# EasyEDA Pro project 单向户外电源_明月班.epro, board PCB2
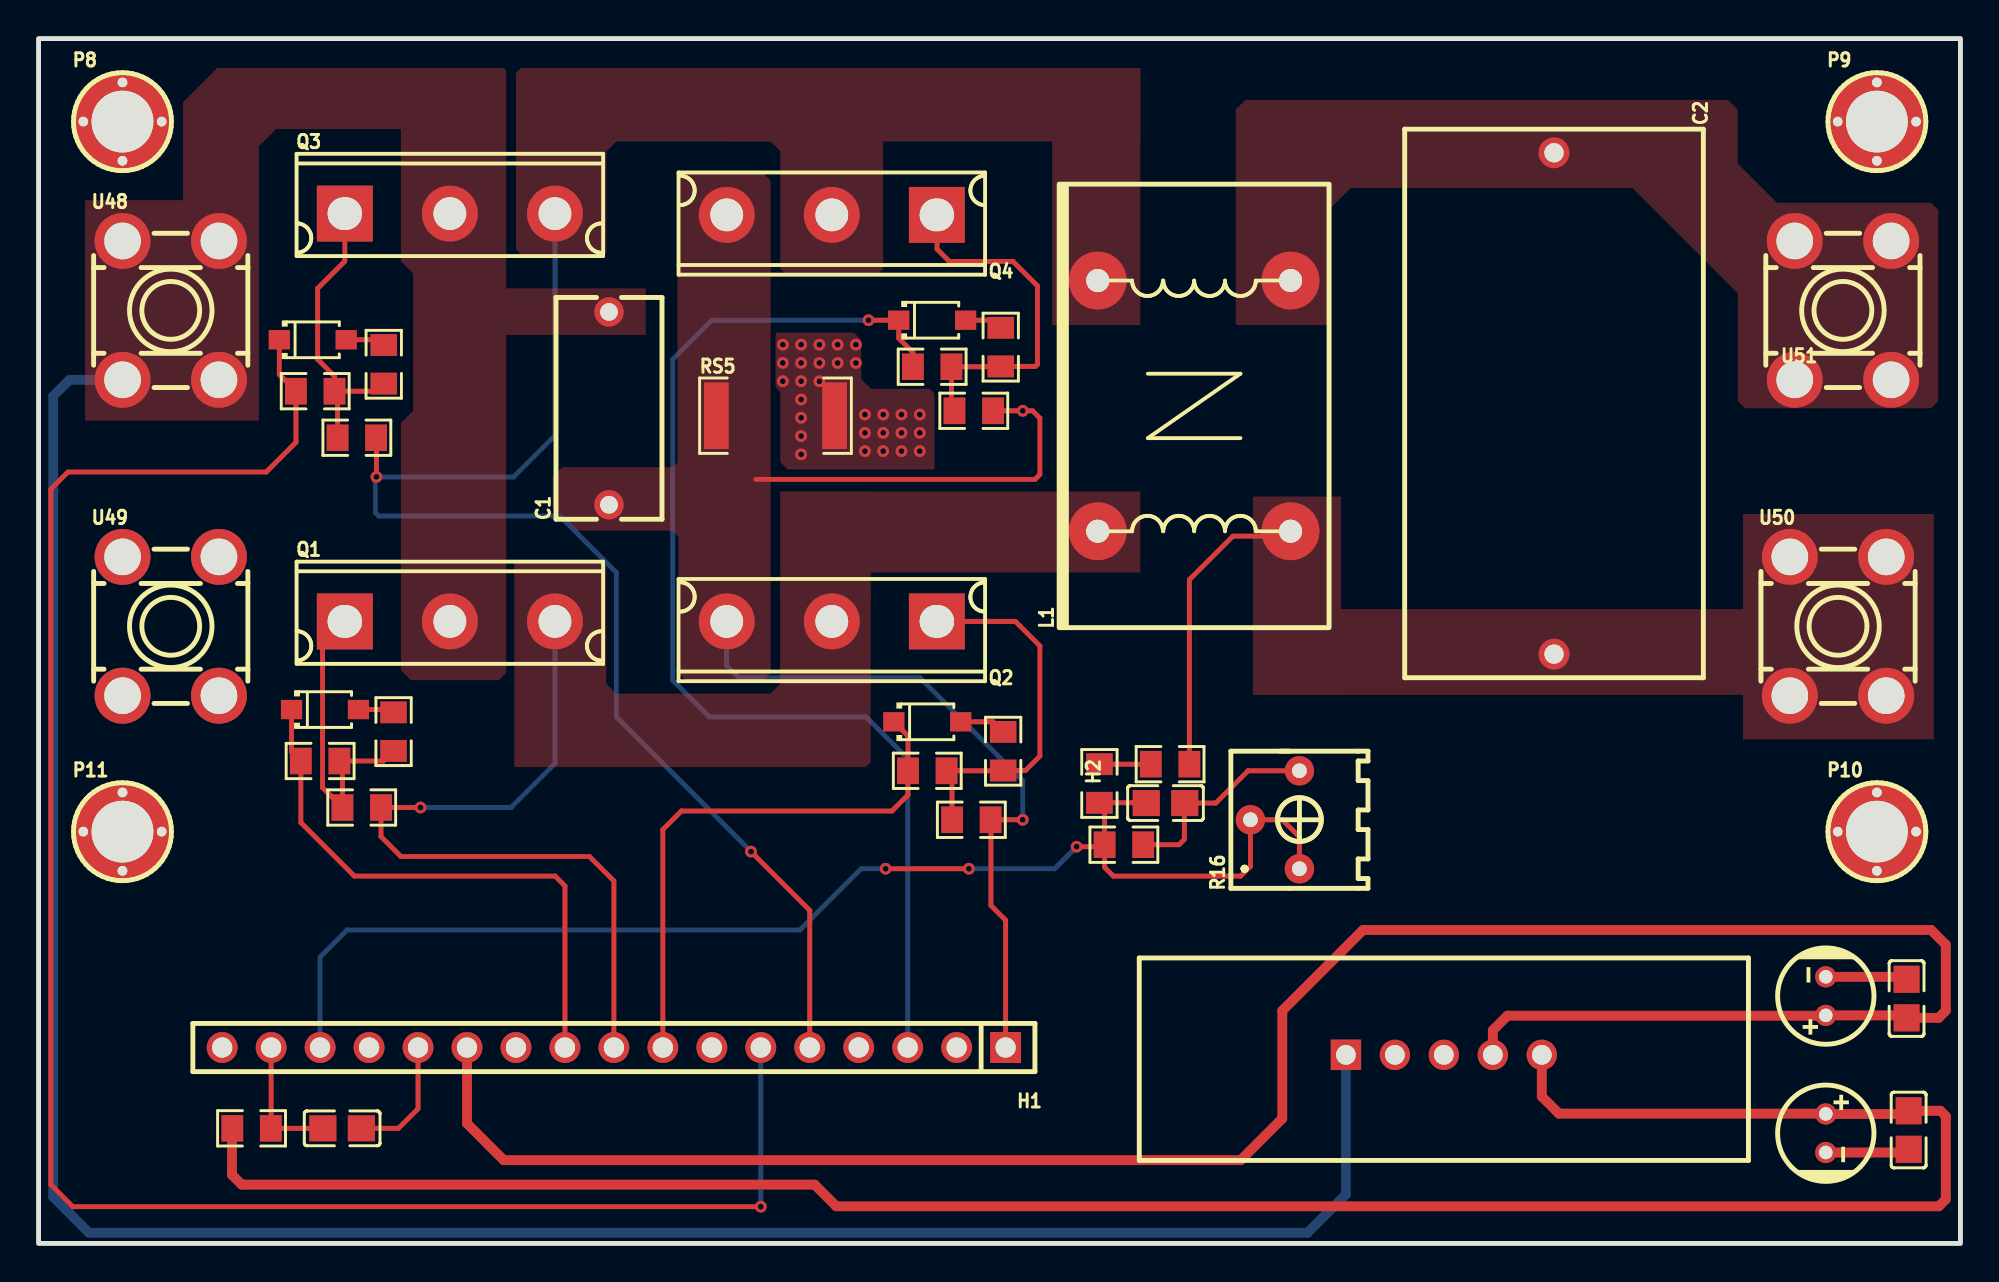
[diagram p10: board, top side]
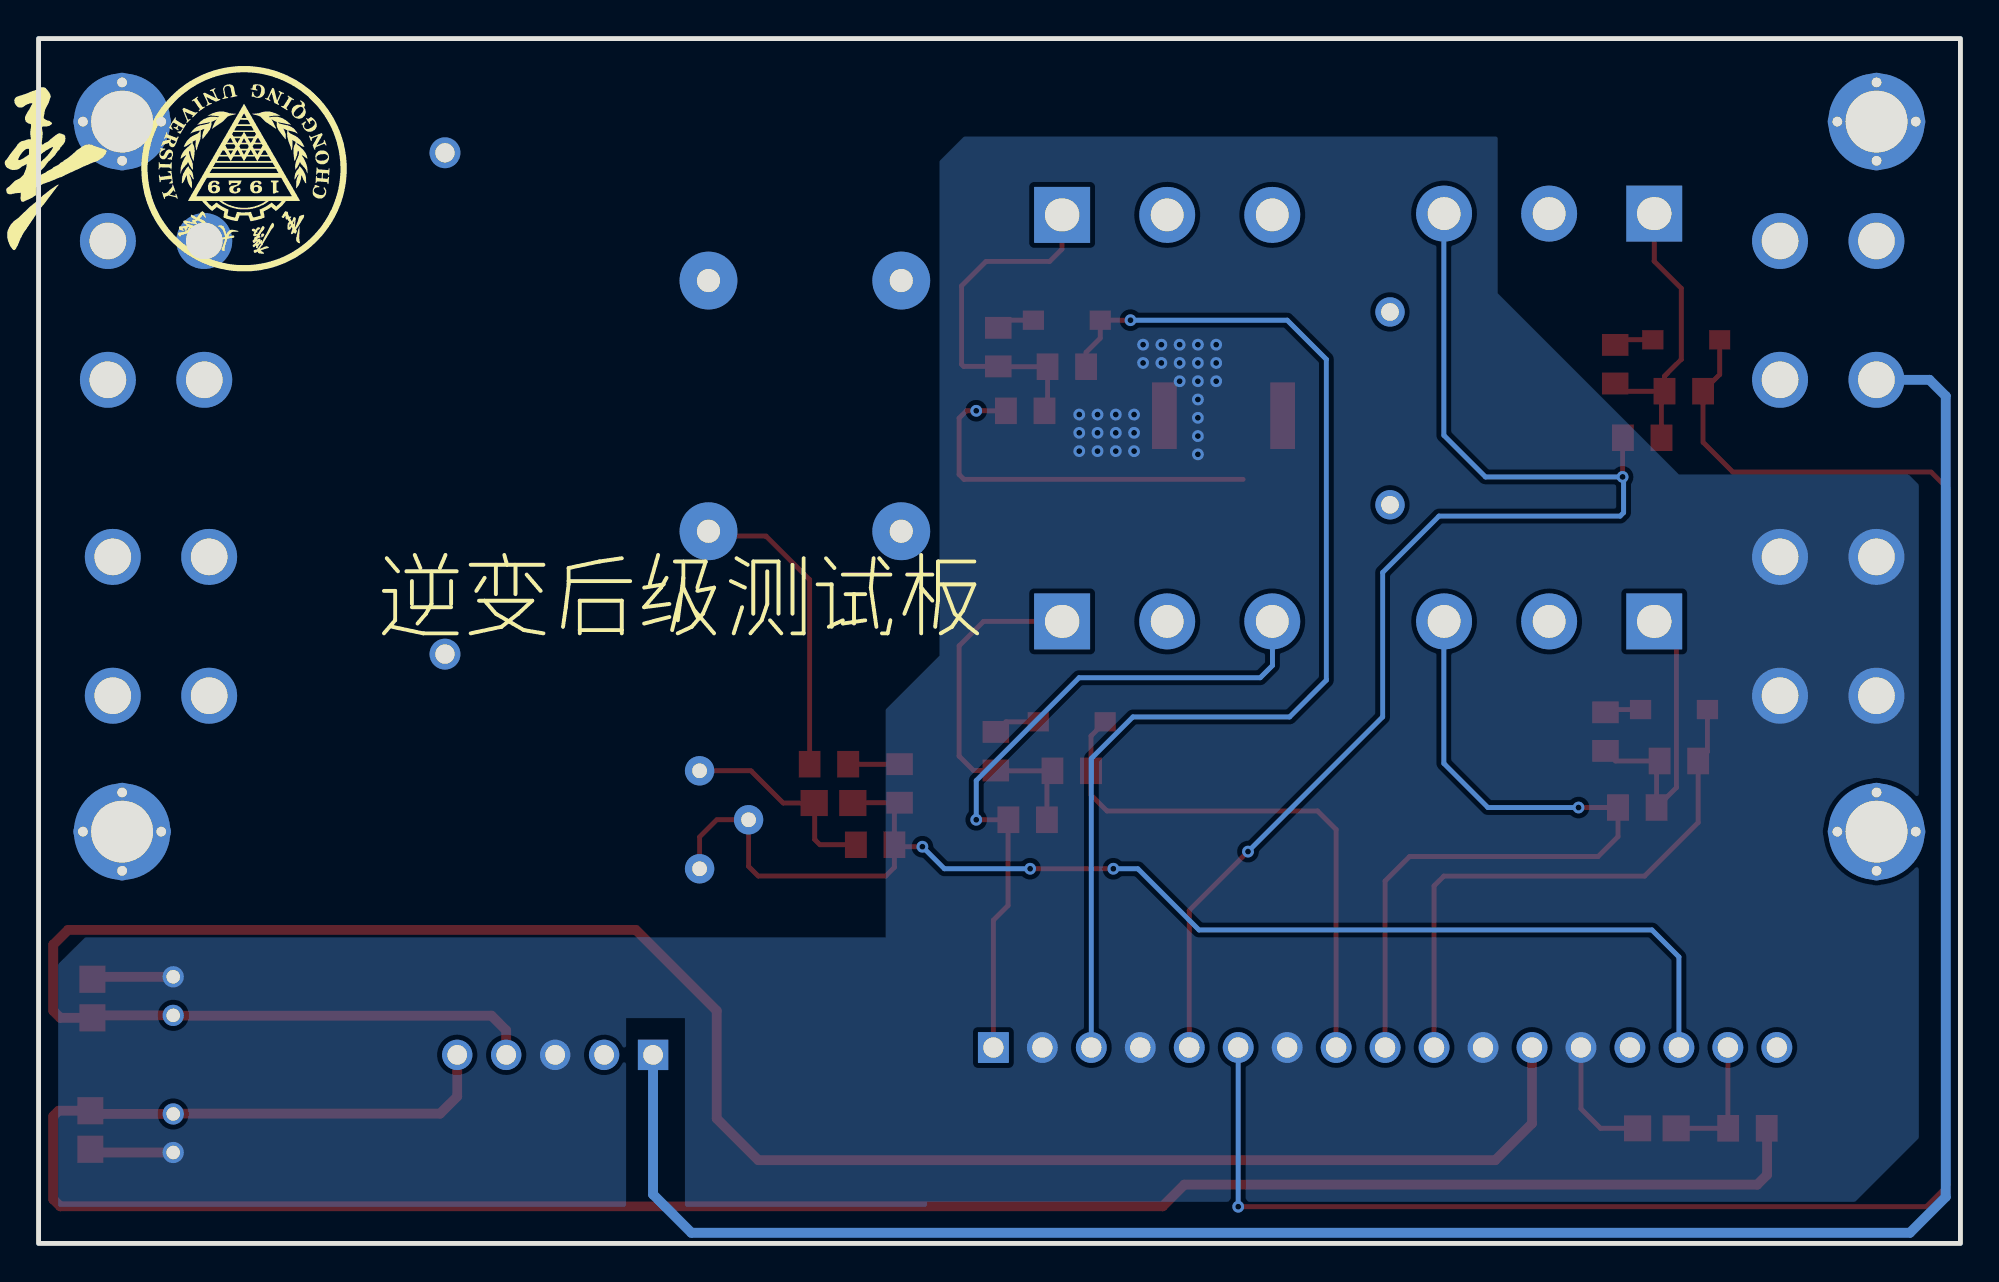
[diagram p11: board, bottom side, seen from below]

Outline 99.7 x 62.48 mm; copper layers: Top Layer, Bottom Layer. Coordinates in mm from the lower left corner of the outline.
Outline path: rectangle 0,62.48 99.7,0
Stack: Top Layer 0.035mm / Dielectric1 1.51mm FR4 er 4.5 / Bottom Layer 0.035mm

## Design rules (mm)
template: 自定义配置
spacing copperThickness1oz (default): track to track 0.102, other pairs 0.152 to 0.3
spacing copperThickness2oz: track to track 0.203, other pairs 0.152 to 0.3
track width copperThickness1oz (default): min 0.127, default 0.254, max 2.54
track width copperThickness2oz: min 0.203, default 0.254, max 2.54
differential pair differentialPair (default): width min 0.127, default 0.254, max 2.54; gap min 0.152, default 0.152
via viaSize (default): diameter min 0.5, default 0.61, max 10; hole min 0.3, default 0.305, max 6.3

## Placement (name value [footprint] x y rotation side)
C1  100nF  [CAP-TH_L11.5-W5.5-P10.00-D0.6]  29.59 43.31 90 top
C2  4.7uF  [CAP-TH_L28.5-W15.5-P26.0-D0.8]  78.61 43.56 270 top
C3  100nF  [C0805]  58.46 22.84 180 top
C7  100uF  [CAP-TH_BD5.0-P2.00-D0.5-FD-1]  92.71 12.83 90 top
C8  100nF  [C0805]  96.9 12.7 270 top
C11  100nF  [C0805]  15.75 5.97 0 top
C12  100uF  [CAP-TH_BD5.0-P2.00-D0.5-FD-1]  92.71 5.72 270 top
C13  100nF  [C0805]  97.01 5.88 90 top
D1  1N4148W  [SOD-123F_L2.7-W1.6-LS3.8-RD]  14.86 27.69 0 top
D2  1N4148W  [SOD-123F_L2.7-W1.6-LS3.8-RD]  46.1 27.05 0 top
D3  1N4148W  [SOD-123F_L2.7-W1.6-LS3.8-RD]  14.22 46.86 0 top
D4  1N4148W  [SOD-123F_L2.7-W1.6-LS3.8-RD]  46.36 47.88 0 top
H1  -  [HDR-TH_17P-P2.54-V-F]  29.85 10.16 180 top
H2  -  [EG1185辅助电源]  72.9 9.78 0 top
L1  -  [SQ1918]  59.94 43.43 90 top
P8  -  [固定孔]  4.35 58.18 0 top
P9  -  [固定孔]  95.36 58.18 0 top
P10  -  [固定孔]  95.36 21.36 0 top
P11  -  [固定孔]  4.35 21.36 0 top
Q1  K40EH5  [TO-247AC-3_L15.8-W5.0-P5.46-L]  21.34 32.26 0 top
Q2  K40EH5  [TO-247AC-3_L15.8-W5.0-P5.46-L]  41.15 32.26 180 top
Q3  K40EH5  [TO-247AC-3_L15.8-W5.0-P5.46-L]  21.34 53.41 0 top
Q4  K40EH5  [TO-247AC-3_L15.8-W5.0-P5.46-L]  41.15 53.34 180 top
R1  20R  [R0805]  14.61 25.02 0 top
R2  10K  [R0805]  16.76 22.61 0 top
R3  4.7R  [R0805]  18.42 26.54 270 top
R5  20R  [R0805]  46.1 24.51 0 top
R6  10K  [R0805]  48.39 21.97 0 top
R7  4.7R  [R0805]  50.04 25.53 270 top
R8  20R  [R0805]  14.35 44.2 0 top
R9  10K  [R0805]  16.51 41.78 0 top
R10  4.7R  [R0805]  17.91 45.59 270 top
R11  20R  [R0805]  46.36 45.47 0 top
R12  10K  [R0805]  48.51 43.18 0 top
R13  4.7R  [R0805]  49.91 46.48 270 top
R14  100K  [R0805]  58.7 24.85 0 top
R15  100K  [R0805]  55.03 23.85 90 top
R16  10K  [RES-ADJ-TH_3362P]  64.14 21.97 90 top
R17  10K  [R0805]  56.3 20.68 180 top
R24  10K  [R0805]  11.05 5.97 180 top
RS5  20mΩ  [R2512]  38.23 42.93 0 top
U48  T44001  [CONN-TH_T44001]  6.86 48.39 0 top
U49  T44001  [CONN-TH_T44001]  6.86 32 0 top
U50  T44001  [CONN-TH_T44001]  93.35 32 0 top
U51  T44001  [CONN-TH_T44001]  93.6 48.39 0 top

## Footprints (pads in the part's own frame, mm; a bottom-side part is the same pattern mirrored in y, then rotated)
C0805
  rect 1.41x1.35 smd: 1(-1,0) 2(1,0)
CAP-TH_BD5.0-P2.00-D0.5-FD-1
  round 1.1 hole 0.7: 1(-1,0) 2(1,0)
CAP-TH_L11.5-W5.5-P10.00-D0.6
  round 1.524 hole 0.914: 1(-5,0) 2(5,0)
CAP-TH_L28.5-W15.5-P26.0-D0.8
  round 1.6 hole 1: 1(-13,0) 2(13,0)
CONN-TH_T44001
  round 2.9 hole 1.9: 1(-2.5,3.6) 2(-2.5,-3.6) 3(2.5,-3.6) 4(2.5,3.6)
EG1185辅助电源
  rect 1.575x1.575 hole 1.02: 1(-5.08,0)
  round 1.575 hole 1.02: 2(-2.54,0) 3(0,0) 4(2.54,0) 5(5.08,0)
HDR-TH_17P-P2.54-V-F
  rect 1.6x1.6 hole 1.05: 1(-20.32,0)
  round 1.6 hole 1.05: 2(-17.78,0) 3(-15.24,0) 4(-12.7,0) 5(-10.16,0) 6(-7.62,0) 7(-5.08,0) 8(-2.54,0) 9(0,0) 10(2.54,0) 11(5.08,0) 12(7.62,0) 13(10.16,0) 14(12.7,0) 15(15.24,0) 16(17.78,0) 17(20.32,0)
R0805
  rect 1.133x1.377 smd: 1(-1,0) 2(1,0)
R2512
  rect 1.282x3.456 smd: 1(-3.067,0) 2(3.067,0)
RES-ADJ-TH_3362P
  round 1.524 hole 0.762: 1(-2.54,-1.27) 2(0,1.27) 3(2.54,-1.27)
SOD-123F_L2.7-W1.6-LS3.8-RD
  rect 1.1x1 smd: 1(-1.735,0) 2(1.735,0)
SQ1918
  round 3 hole 1.2: 1(-6.5,5) 2(6.5,5) 3(6.5,-5) 4(-6.5,-5)
TO-247AC-3_L15.8-W5.0-P5.46-L
  rect 2.9x2.9 hole 1.785x1.7: 1(-5.45,0)
  round 2.9 hole 1.7: 2(0,0) 3(5.45,0)
固定孔
  round 1 hole 0.5x0.505: 1(-2.032,0) 3(2.032,0)
  round 1 hole 0.505x0.5: 2(0,-2.032) 4(0,2.032)
  round 5 hole 3.205x3.2: 5(0,0)

## Nets
5V: C12.1 C13.2 H2.5 R24.2
15V: C7.1 C8.2 H1.12 H2.4
400V: C1.2 H2.1 Q1.2 Q3.2 U48.1 U48.2 U48.3 U48.4
GND-400V: C7.2 C8.1 C11.2 C12.2 C13.1 H1.2 H1.4 H1.7 H1.11 H1.13 H2.3 RS5.2 U49.1 U49.2 U49.3 U49.4
1HO: D3.1 H1.6 R8.1
1LO: D4.1 H1.3 R11.1
2HO: D1.1 H1.10 R1.1
2LO: D2.1 H1.8 R5.1
L: C2.2 L1.4 R14.2 U50.1 U50.2 U50.3 U50.4
N: C2.1 L1.3 U51.1 U51.2 U51.3 U51.4
VFB: C3.2 H1.15 R15.1 R16.1 R16.2 R17.2
VS1: H1.5 L1.2 Q3.3 Q4.2 R9.2
VS2: H1.9 L1.1 Q1.3 Q2.2 R2.2
$1N462: D1.2 R3.1
$1N467: Q1.1 R1.2 R2.1 R3.2
$1N750: D2.2 R7.1
$1N752: Q2.1 R5.2 R6.1 R7.2
$1N762: C1.1 H1.1 Q2.3 Q4.3 R6.2 R12.2 RS5.1
$1N1150: D3.2 R10.1
$1N1152: Q3.1 R8.2 R9.1 R10.2
$1N1168: D4.2 R13.1
$1N1170: Q4.1 R11.2 R12.1 R13.2
$1N1865: R14.1 R15.2
$1N2048: C3.1 R16.3 R17.1
$1N2358: C11.1 H1.16 R24.1

Pads without a net: H1 14 17; H2 2; P8 1 2 3 4 5; P9 1 2 3 4 5; P10 1 2 3 4 5; P11 1 2 3 4 5

## Via types
v1: diameter 0.61, hole 0.305, Top Layer to Bottom Layer, 39 vias

## Routing (per net, layer and track width the routed paths; a pad name or vN(x,y) marks a point on that pad's centre or on a via; arc(x,y) is an arc through that point)
5V: length 120.1
  Top Layer w0.508: R24.2 10.03,5.95 10.03,3.56 10.54,3.05 40.26,3.05 41.38,1.93 98.57,1.93 98.93,2.29 98.93,6.6 98.66,6.88 C13.2 96.84,6.72 C12.1 92.69,6.73 78.87,6.73 77.98,7.62 77.98,9.78
15V: length 118.7
  Top Layer w0.508: H2.4 75.44,11.05 76.2,11.81 92.69,11.81 C7.1 96.77,11.83 C8.2 98.57,11.7 98.93,12.07 98.93,15.49 98.17,16.26 68.71,16.26 64.52,12.07 64.52,6.48 62.36,4.32 24.13,4.32 22.23,6.22 H1.12
400V: length 121.4
  Bottom Layer w0.508: H2.1 67.82,2.54 65.83,0.55 2.62,0.55 0.76,2.41 0.76,43.94 1.61,44.79 4.36,44.79
GND-400V: length 15.1
  Top Layer w0.254: H1.13 19.69,6.99 18.67,5.97 C11.2
  Top Layer w0.508: C8.1 96.77,13.83 C7.2 ; C13.1 96.84,4.72 C12.2
  vias: v1(38.61,46.61) v1(38.61,45.66) v1(38.61,44.71) v1(39.56,46.61) v1(39.56,45.66) v1(39.56,44.71) v1(39.56,43.77) v1(39.56,42.82) v1(39.56,41.87) v1(39.56,40.92) v1(40.5,46.61) v1(40.5,45.66) v1(40.5,44.71) v1(41.45,46.61) v1(41.45,45.66) v1(42.4,46.61) v1(42.4,45.66) v1(42.87,42.99) v1(42.87,42.04) v1(42.87,41.09) v1(43.82,42.99) v1(43.82,42.04) v1(43.82,41.09) v1(44.76,42.99) v1(44.76,42.04) v1(44.76,41.09) v1(45.71,42.99) v1(45.71,42.04) v1(45.71,41.09)
1HO: length 101
  Top Layer w0.254: v1(37.47,1.91) 1.78,1.91 0.64,3.05 0.64,39.12 1.52,40.01 11.81,40.01 13.35,41.55 R8.1 12.49,45.06 D3.1
  Bottom Layer w0.254: v1(37.47,1.91) H1.6
1LO: length 60.8
  Top Layer w0.254: R11.1 45.36,46.21 44.62,46.95 D4.1 v1(43.05,47.88)
  Bottom Layer w0.254: v1(43.05,47.88) 34.92,47.88 32.89,45.85 32.89,29.21 34.8,27.31 42.93,27.31 45.08,25.15 H1.3
2HO: length 29.5
  Top Layer w0.254: D1.1 13.12,25.5 R1.1 13.61,21.83 16.38,19.05 26.8,19.05 27.31,18.54 H1.10
2LO: length 28.9
  Top Layer w0.254: D2.1 45.1,26.32 R5.1 45.1,23.26 44.27,22.43 33.35,22.43 32.39,21.46 H1.8
L: length 15.9
  Top Layer w0.254: R14.2 59.7,34.42 61.95,36.68 65.07,36.68
VFB: length 68.6
  Top Layer w0.254: R17.2 55.3,19.5 55.75,19.05 62.36,19.05 62.86,19.56 R16.2 64.52,21.97 65.41,21.08 R16.1 ; R17.2 55.2,20.57 v1(53.85,20.57) ; R17.2 55.3,22.58 R15.1 57.44,22.85 C3.2 ; v1(43.94,19.43) v1(48.26,19.43)
  Bottom Layer w0.254: v1(53.85,20.57) 52.7,19.43 v1(48.26,19.43) ; v1(43.94,19.43) 42.67,19.43 39.5,16.26 16,16.26 14.61,14.86 H1.15
VS1: length 68.2
  Top Layer w0.254: v1(36.96,20.32) 40.01,17.27 H1.5 ; v1(17.53,39.75) 17.53,41.77 R9.2
  Bottom Layer w0.254: Q3.3 26.8,53.4 26.8,41.91 24.64,39.75 v1(17.53,39.75) 17.47,39.7 17.47,37.9 17.65,37.72 27.05,37.72 29.97,34.8 29.97,27.31 v1(36.96,20.32)
VS2: length 40.5
  Top Layer w0.254: H1.9 29.85,18.8 28.58,20.07 18.8,20.07 17.76,21.1 R2.2 v1(19.81,22.61)
  Bottom Layer w0.254: Q1.3 26.8,32.25 26.8,24.89 24.51,22.61 v1(19.81,22.61)
$1N462: length 1.9
  Top Layer w0.254: D1.2 18.27,27.69 R3.1
$1N467: length 16.1
  Top Layer w0.254: Q1.1 14.73,31.1 14.73,23.64 R2.1 15.76,24.86 R1.2 17.89,25.02 R3.2
$1N750: length 2.4
  Top Layer w0.254: R7.1 49.51,27.05 D2.2
$1N752: length 19.4
  Top Layer w0.254: R6.1 47.39,24.23 R5.2 50.02,24.51 R7.2 51.2,24.53 51.94,25.27 51.94,30.99 50.67,32.26 Q2.1
$1N762: length 56.3
  Top Layer w0.254: H1.1 50.17,16.76 49.4,17.53 49.4,21.96 R6.2 v1(51.05,21.97) ; R12.2 v1(51.05,43.18) 51.56,43.18 51.94,42.8 51.94,39.88 51.69,39.62 37.21,39.62
  Bottom Layer w0.254: 35.7,32.26 35.69,32.25 35.69,29.97 36.32,29.34 45.72,29.34 51.05,24 v1(51.05,21.97)
$1N1150: length 2.1
  Top Layer w0.254: D3.2 17.64,46.86 R10.1
$1N1152: length 15.5
  Top Layer w0.254: R8.2 15.35,44.97 14.48,45.85 14.48,49.53 15.89,50.94 Q3.1 ; R8.2 15.51,44.04 R9.1 15.38,41.66 ; R8.2 17.51,44.2 R10.2
$1N1168: length 2
  Top Layer w0.254: D4.2 49.51,47.88 R13.1
$1N1170: length 18.7
  Top Layer w0.254: R12.1 47.36,43.34 R11.2 49.89,45.47 R13.2 51.7,45.48 51.82,45.59 51.82,49.66 50.55,50.93 47.24,50.93 46.61,51.56 46.61,53.33 Q4.1
$1N1865: length 2.7
  Top Layer w0.254: R15.2 R14.1
$1N2048: length 10.8
  Top Layer w0.254: R17.1 59.16,20.68 59.44,20.96 59.44,22.82 C3.1 61.06,22.84 62.74,24.51 R16.3
$1N2358: length 6.9
  Top Layer w0.254: C11.1 12.06,5.97 H1.16

## Copper pours and planes (outline as drawn; the poured copper is in the pictures)
400V on Top Layer: 2.41,54.1 11.43,54.1 11.43,42.67 2.41,42.67
400V on Top Layer: 23.24,49.53 31.5,49.53 31.5,47.12 23.24,47.12
400V on Top Layer: 7.49,53.72 7.49,59.18 9.27,60.96 24.13,60.96 24.26,60.83 24.26,29.59 23.88,29.21 19.3,29.21 18.8,29.72 18.8,42.55 19.43,43.18 19.43,50.29 18.8,50.93 18.8,57.79 12.33,57.79 11.43,56.9 11.43,52.77 8.44,52.77
GND-400V on Top Layer: 38.23,47.24 42.29,47.24 42.67,46.86 42.67,44.83 43.18,44.32 46.23,44.32 46.48,44.07 46.48,40.13 38.86,40.13 38.48,40.51 38.48,44.16 38.23,44.41
GND-400V on Bottom Layer: 2.68,39.88 14.61,39.88 24,49.28 24,57.4 51.69,57.4 52.96,56.13 52.96,30.48 55.75,27.69 55.75,2.54 55.37,2.16 5.46,2.16 2.16,5.46 2.16,39.35
GND-400V on Bottom Layer: 55.25,15.88 97.28,15.88 98.68,14.48 98.68,1.91 53.59,1.91 53.59,6.48 53.34,6.73 53.34,13.97
L on Top Layer: 88.41,37.83 98.32,37.83 98.32,26.14 88.41,26.14
L on Top Layer: 62.99,38.74 67.56,38.74 67.56,28.45 62.99,28.45
L on Top Layer: 62.99,32.89 97.54,32.89 97.54,28.45 62.99,28.45
N on Top Layer: 62.1,47.63 62.1,58.8 62.61,59.31 87.63,59.31 88.14,58.8 88.14,56.01 90.17,53.98 98.17,53.98 98.55,53.59 98.55,43.69 98.17,43.31 88.52,43.31 88.14,43.69 88.14,49.28 82.68,54.74 68.07,54.74 66.94,53.61 66.94,47.69 66.88,47.63
VS1 on Top Layer: 25.12,51.21 24.77,51.56 24.77,60.71 25.02,60.96 43.56,60.96 43.82,60.71 43.82,50.54 43.51,50.24 38.79,50.24 38.48,50.55 38.48,56.64 37.97,57.15 29.97,57.15 29.46,56.64 29.46,51.38 29.29,51.21
VS1 on Top Layer: 52.58,60.96 57.15,60.96 57.15,47.63 52.58,47.63
VS1 on Top Layer: 35.94,60.96 57.15,60.96 57.15,57.15 35.94,57.15
VS2 on Top Layer: 42.81,34.46 43.17,34.1 43.17,24.96 42.92,24.71 24.68,24.71 24.68,35.43 29.15,35.43 29.45,35.12 29.45,29.02 29.96,28.52 37.96,28.52 38.47,29.02 38.47,34.28 38.65,34.46
VS2 on Top Layer: 38.48,38.99 57.15,38.99 57.15,34.8 38.48,34.8
VS2 on Top Layer: 38.48,38.99 43.17,38.99 43.17,33.27 38.48,33.27
$1N762 on Top Layer: 33.2,55.54 37.55,55.54 37.97,55.12 37.97,29.57 37.56,29.16 33.6,29.16 33.2,29.56 33.2,36.65 32.89,36.96 27.94,36.96 26.67,38.23 26.67,39.75 27.18,40.26 32.89,40.26 33.15,40.51 33.15,55.49

## Text on the board
Bottom Silkscreen Layer: 逆变后级测试板
